# EAGLE schematic interface_board (EAGLE 7.1.0)
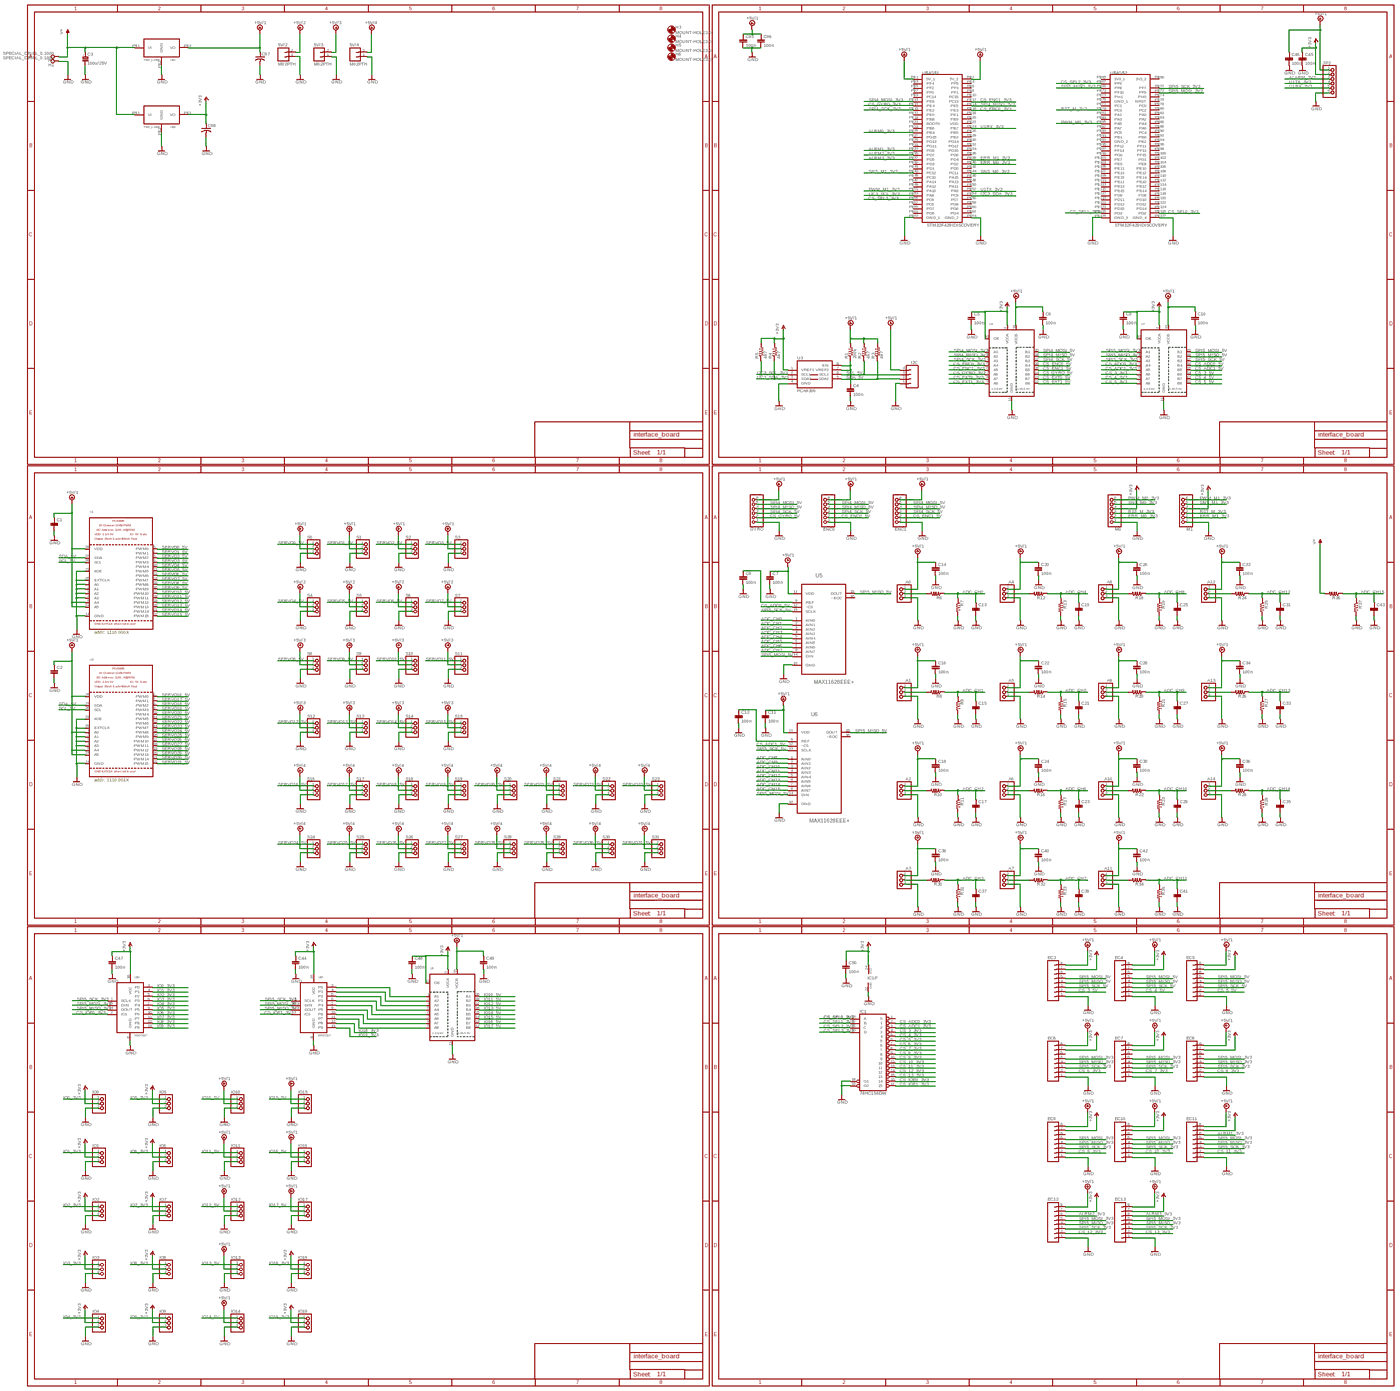
[diagram p0: schematic, sheet 1, overview]
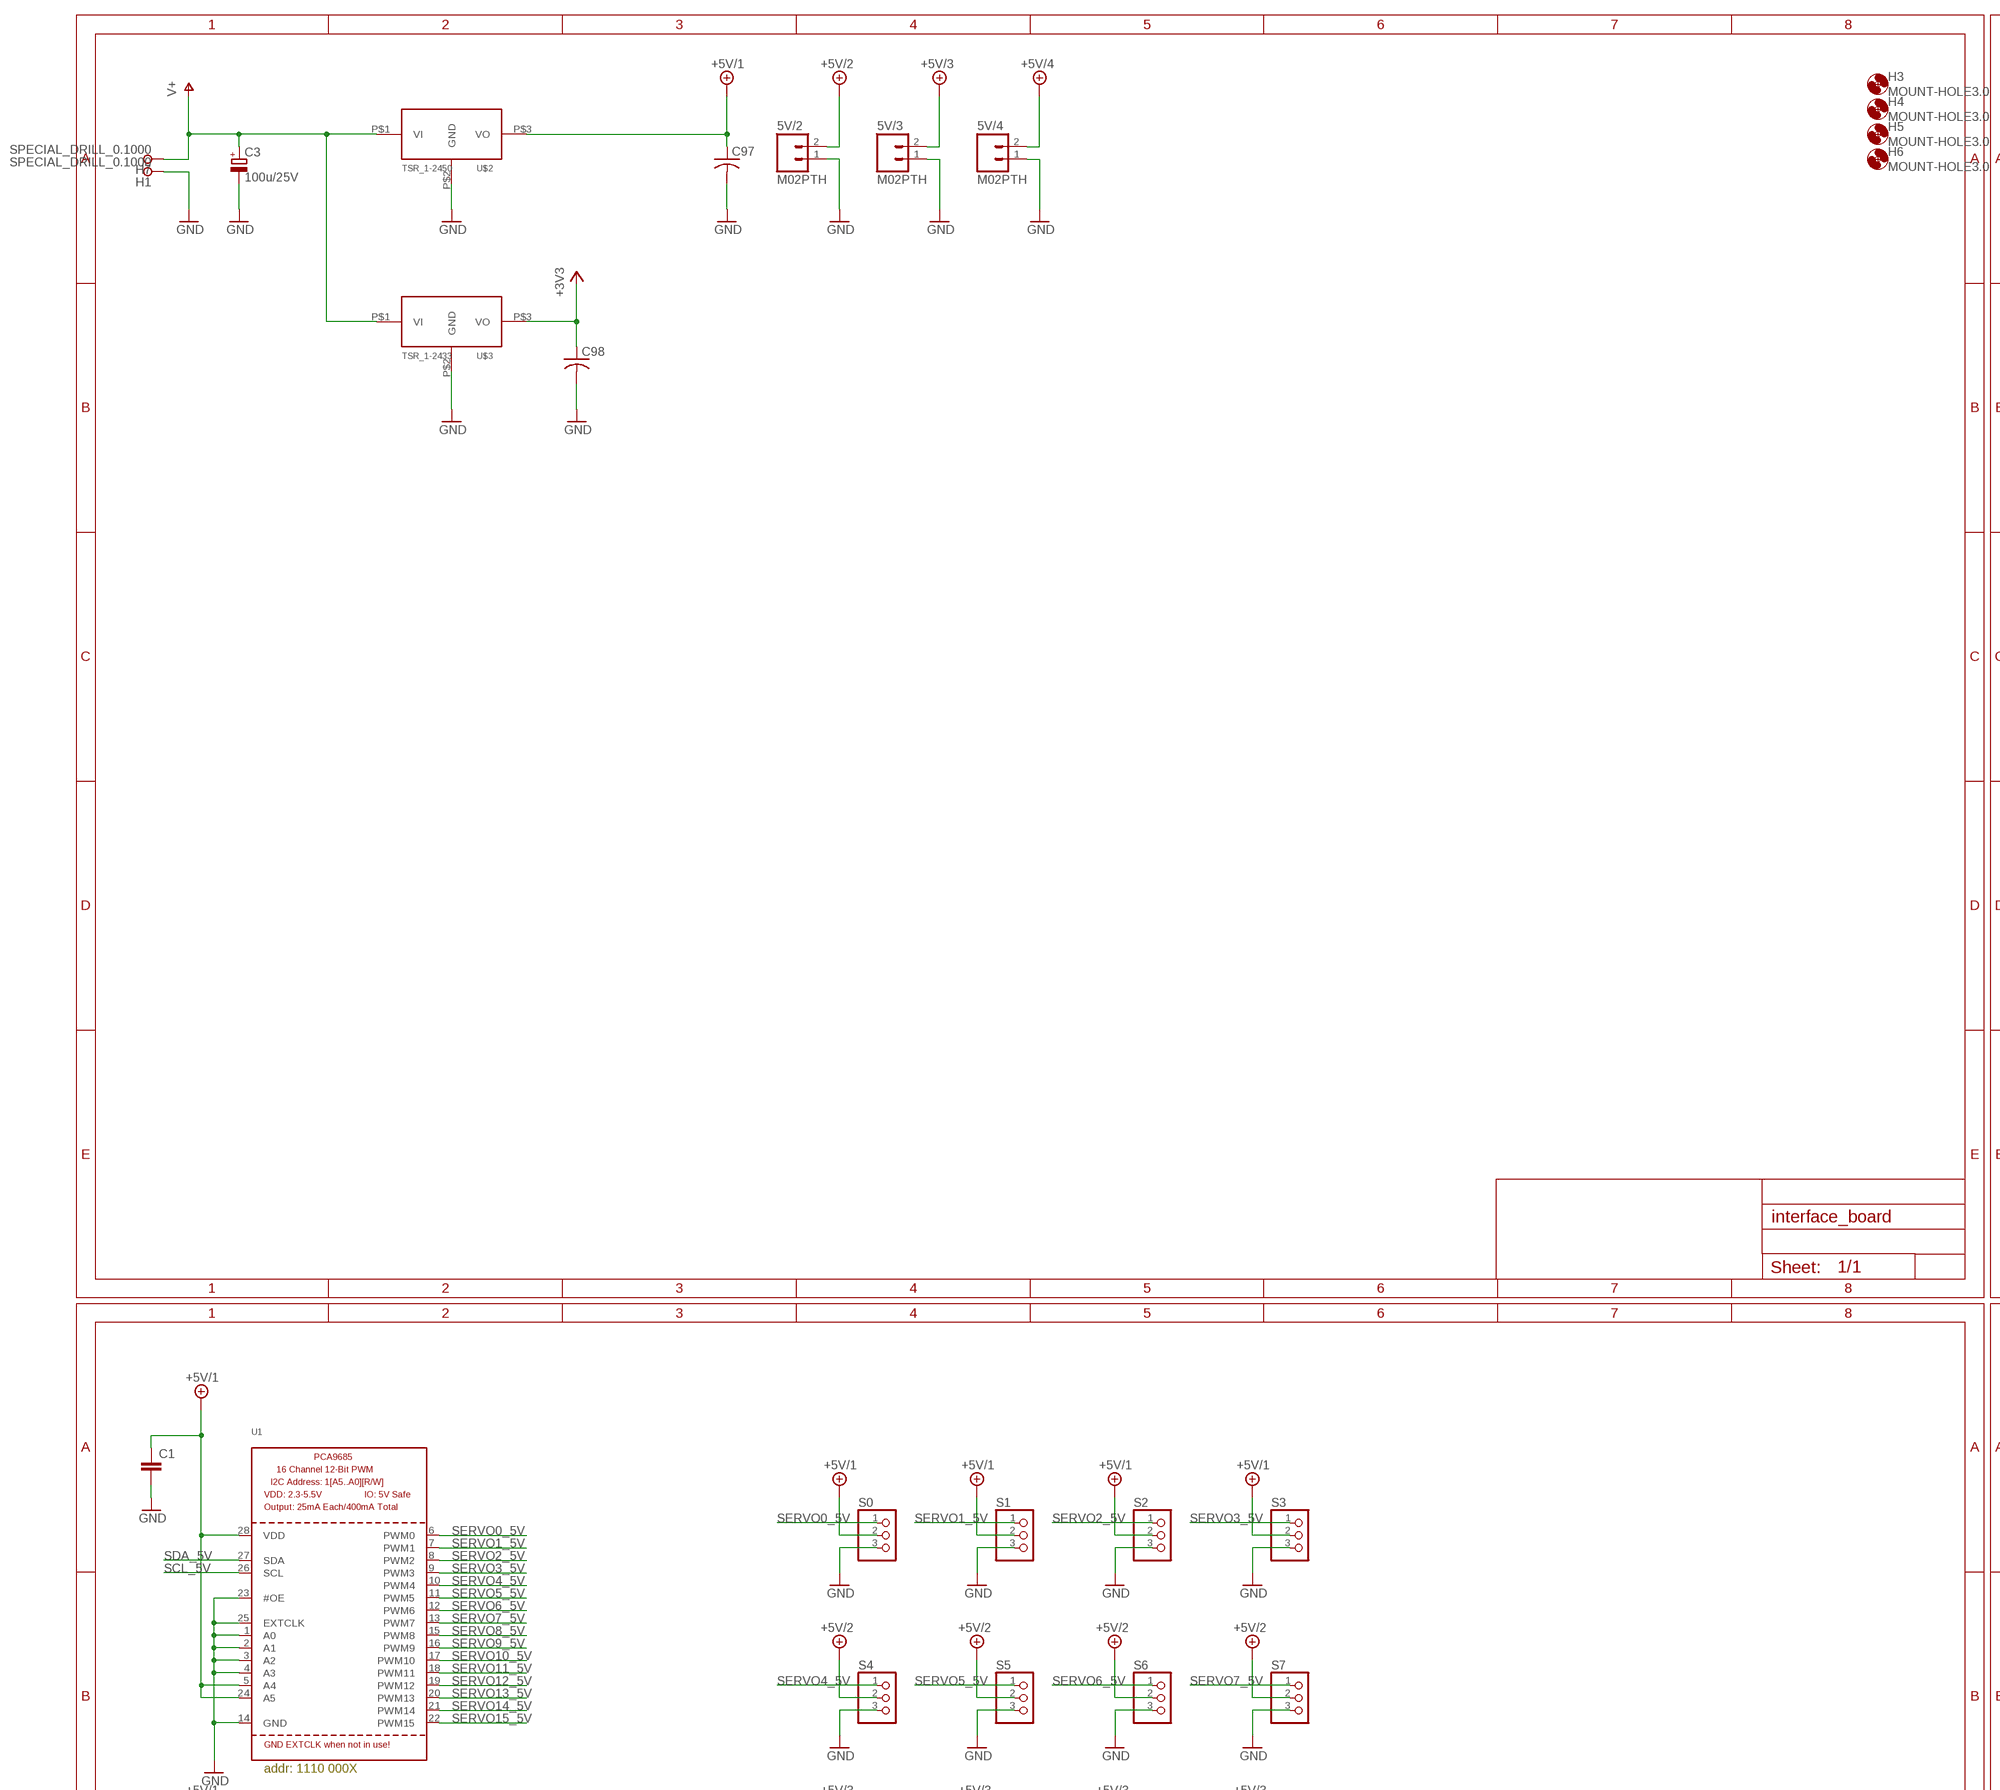
[diagram p1: schematic, sheet 1, part 1 of 4]
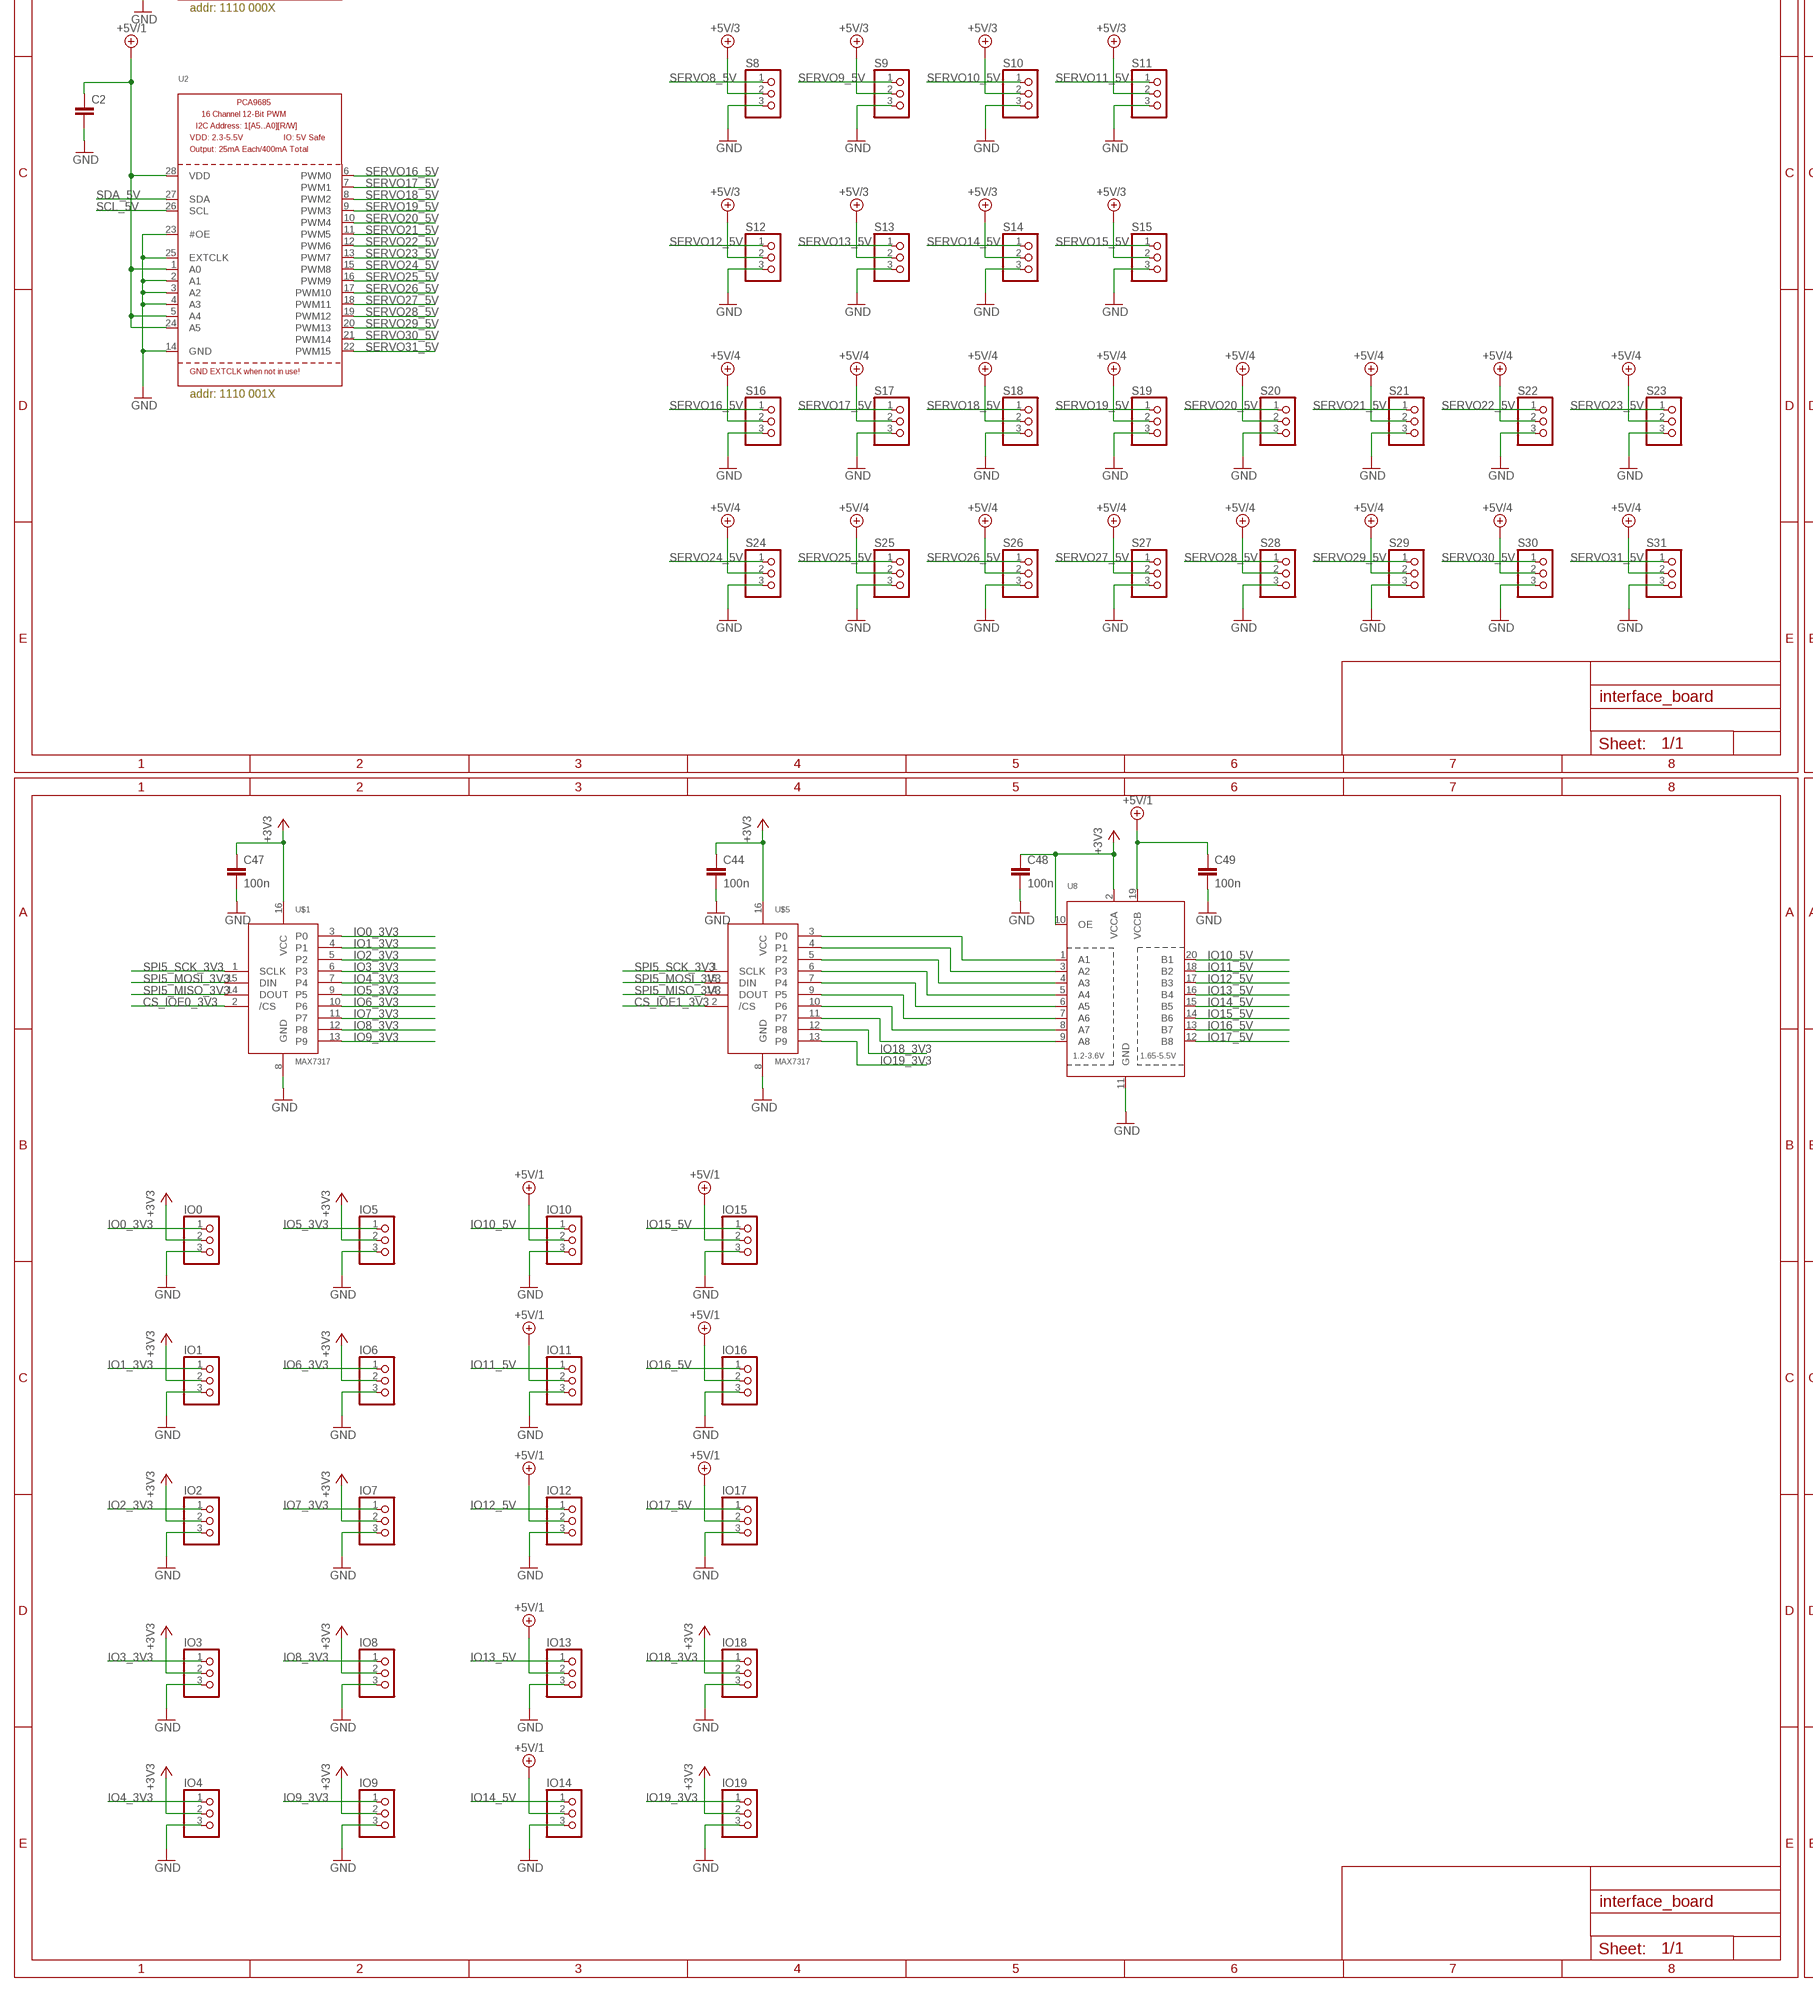
[diagram p2: schematic, sheet 1, part 2 of 4]
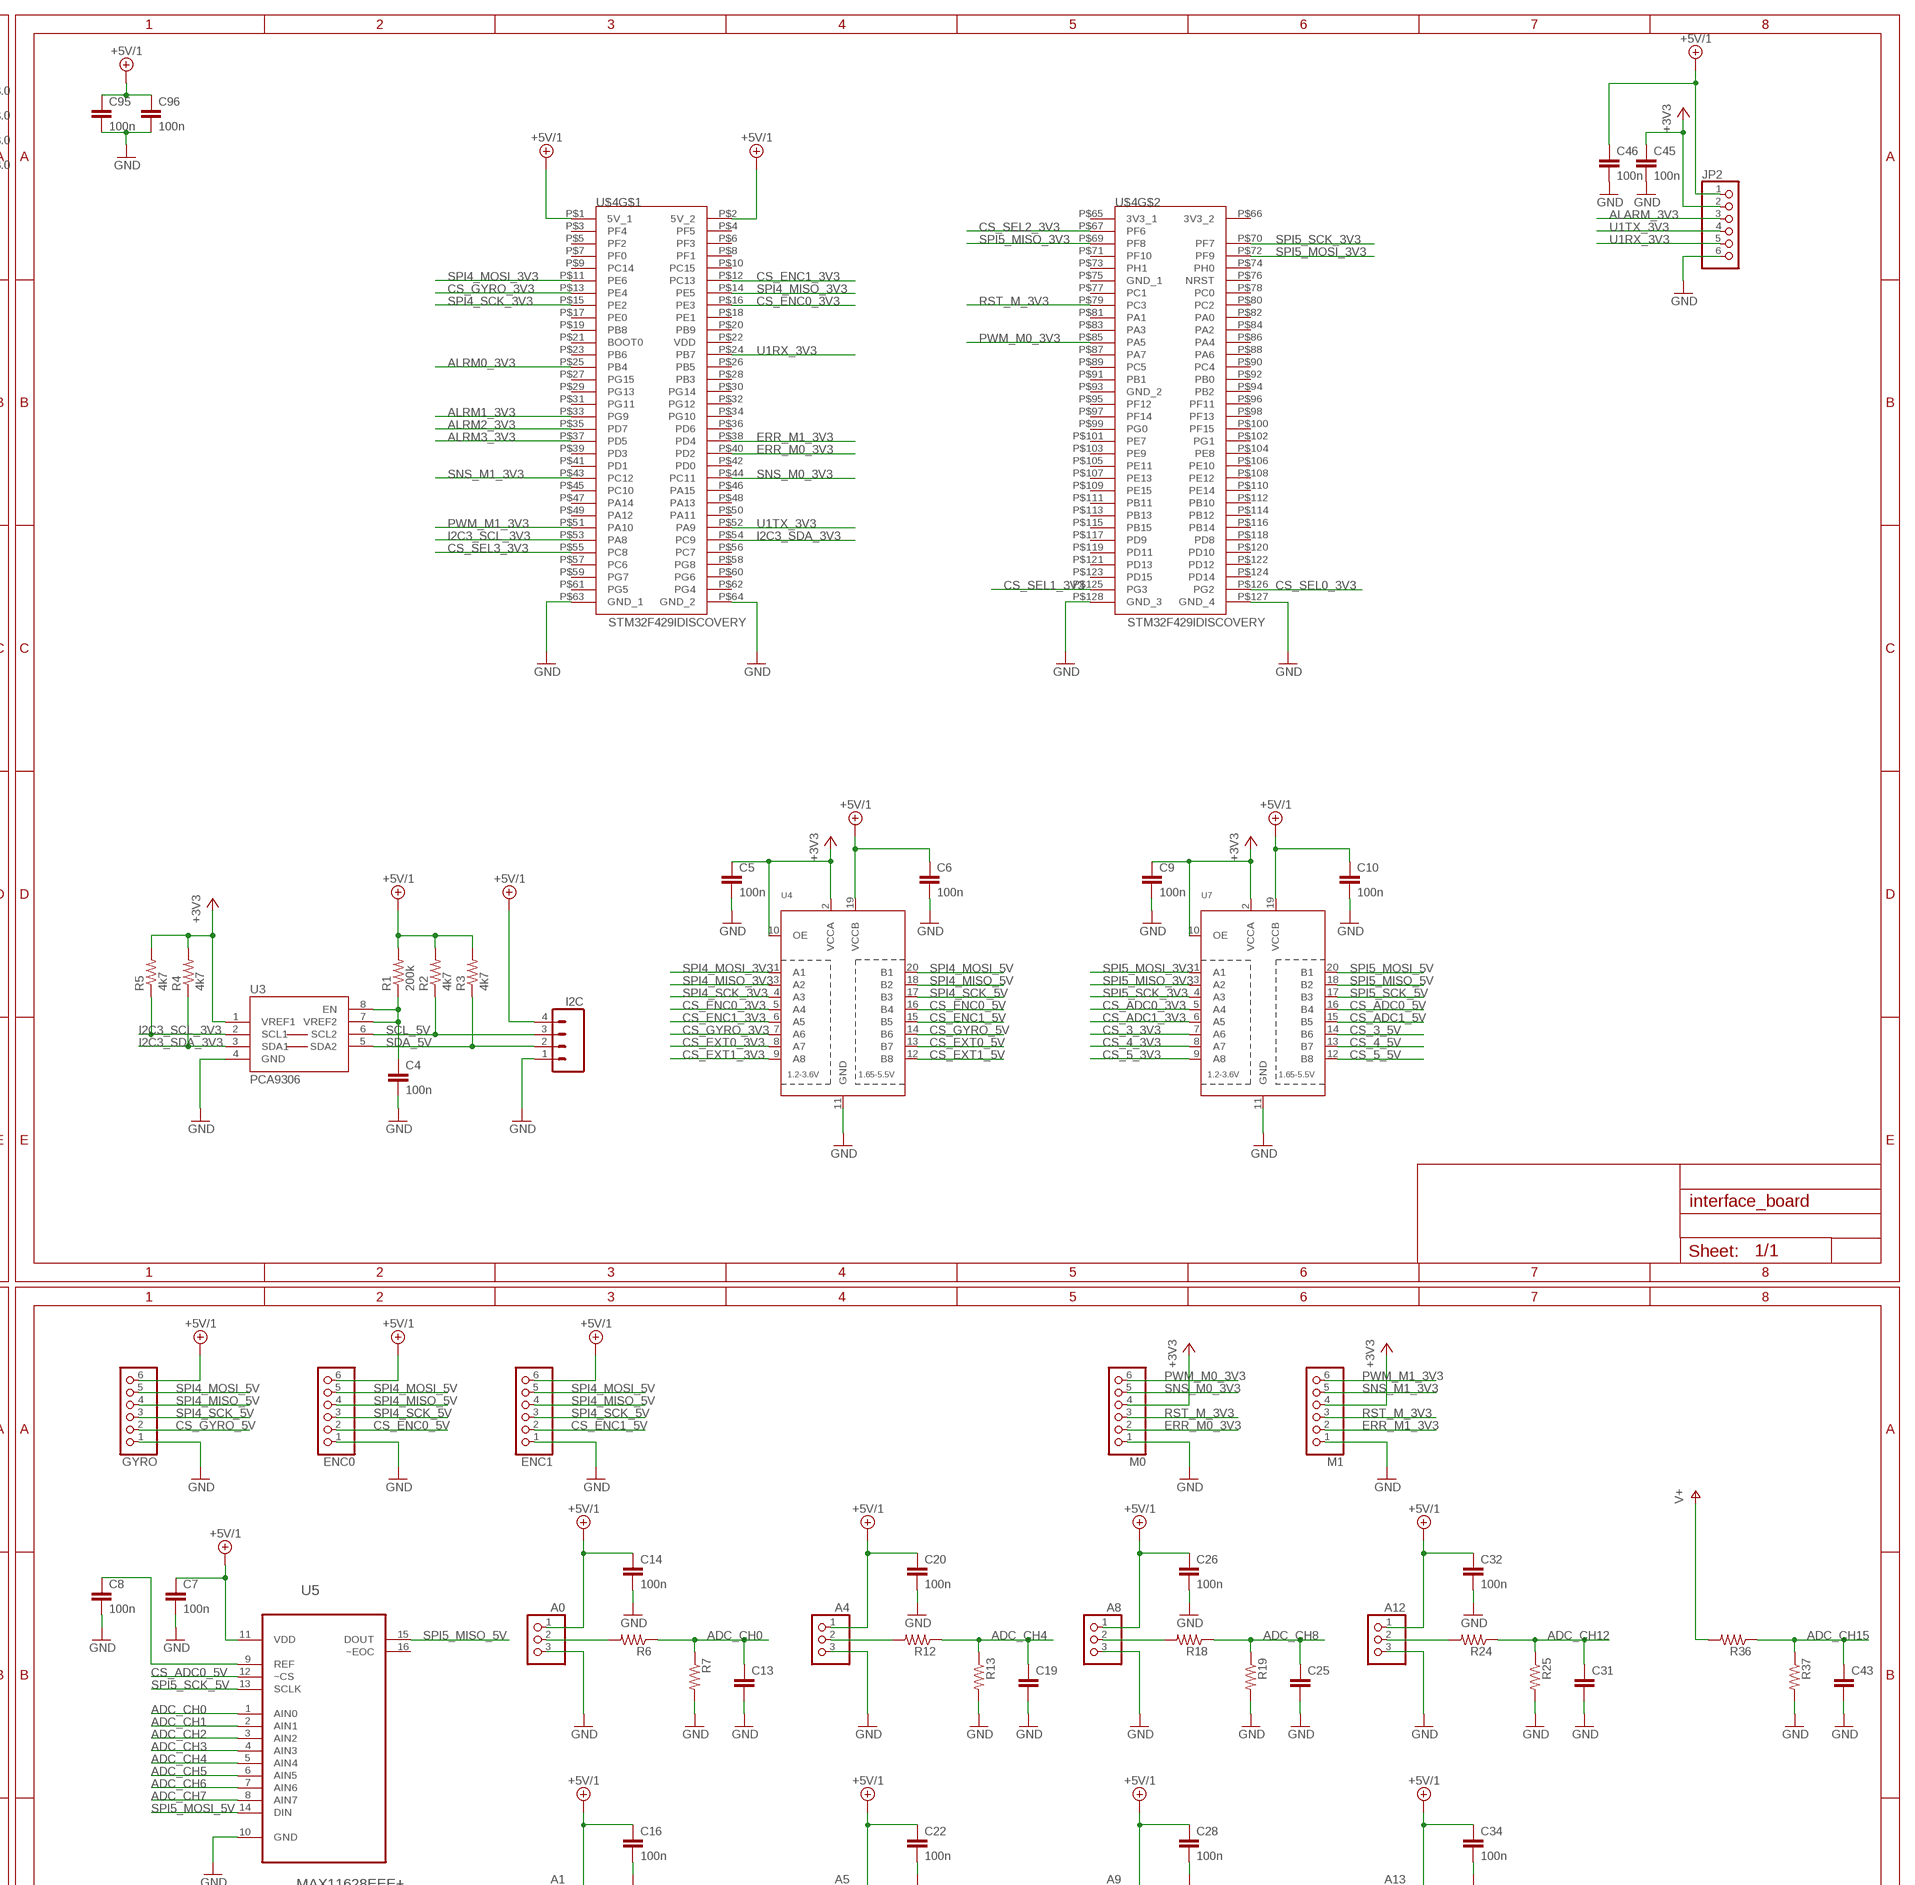
[diagram p3: schematic, sheet 1, part 3 of 4]
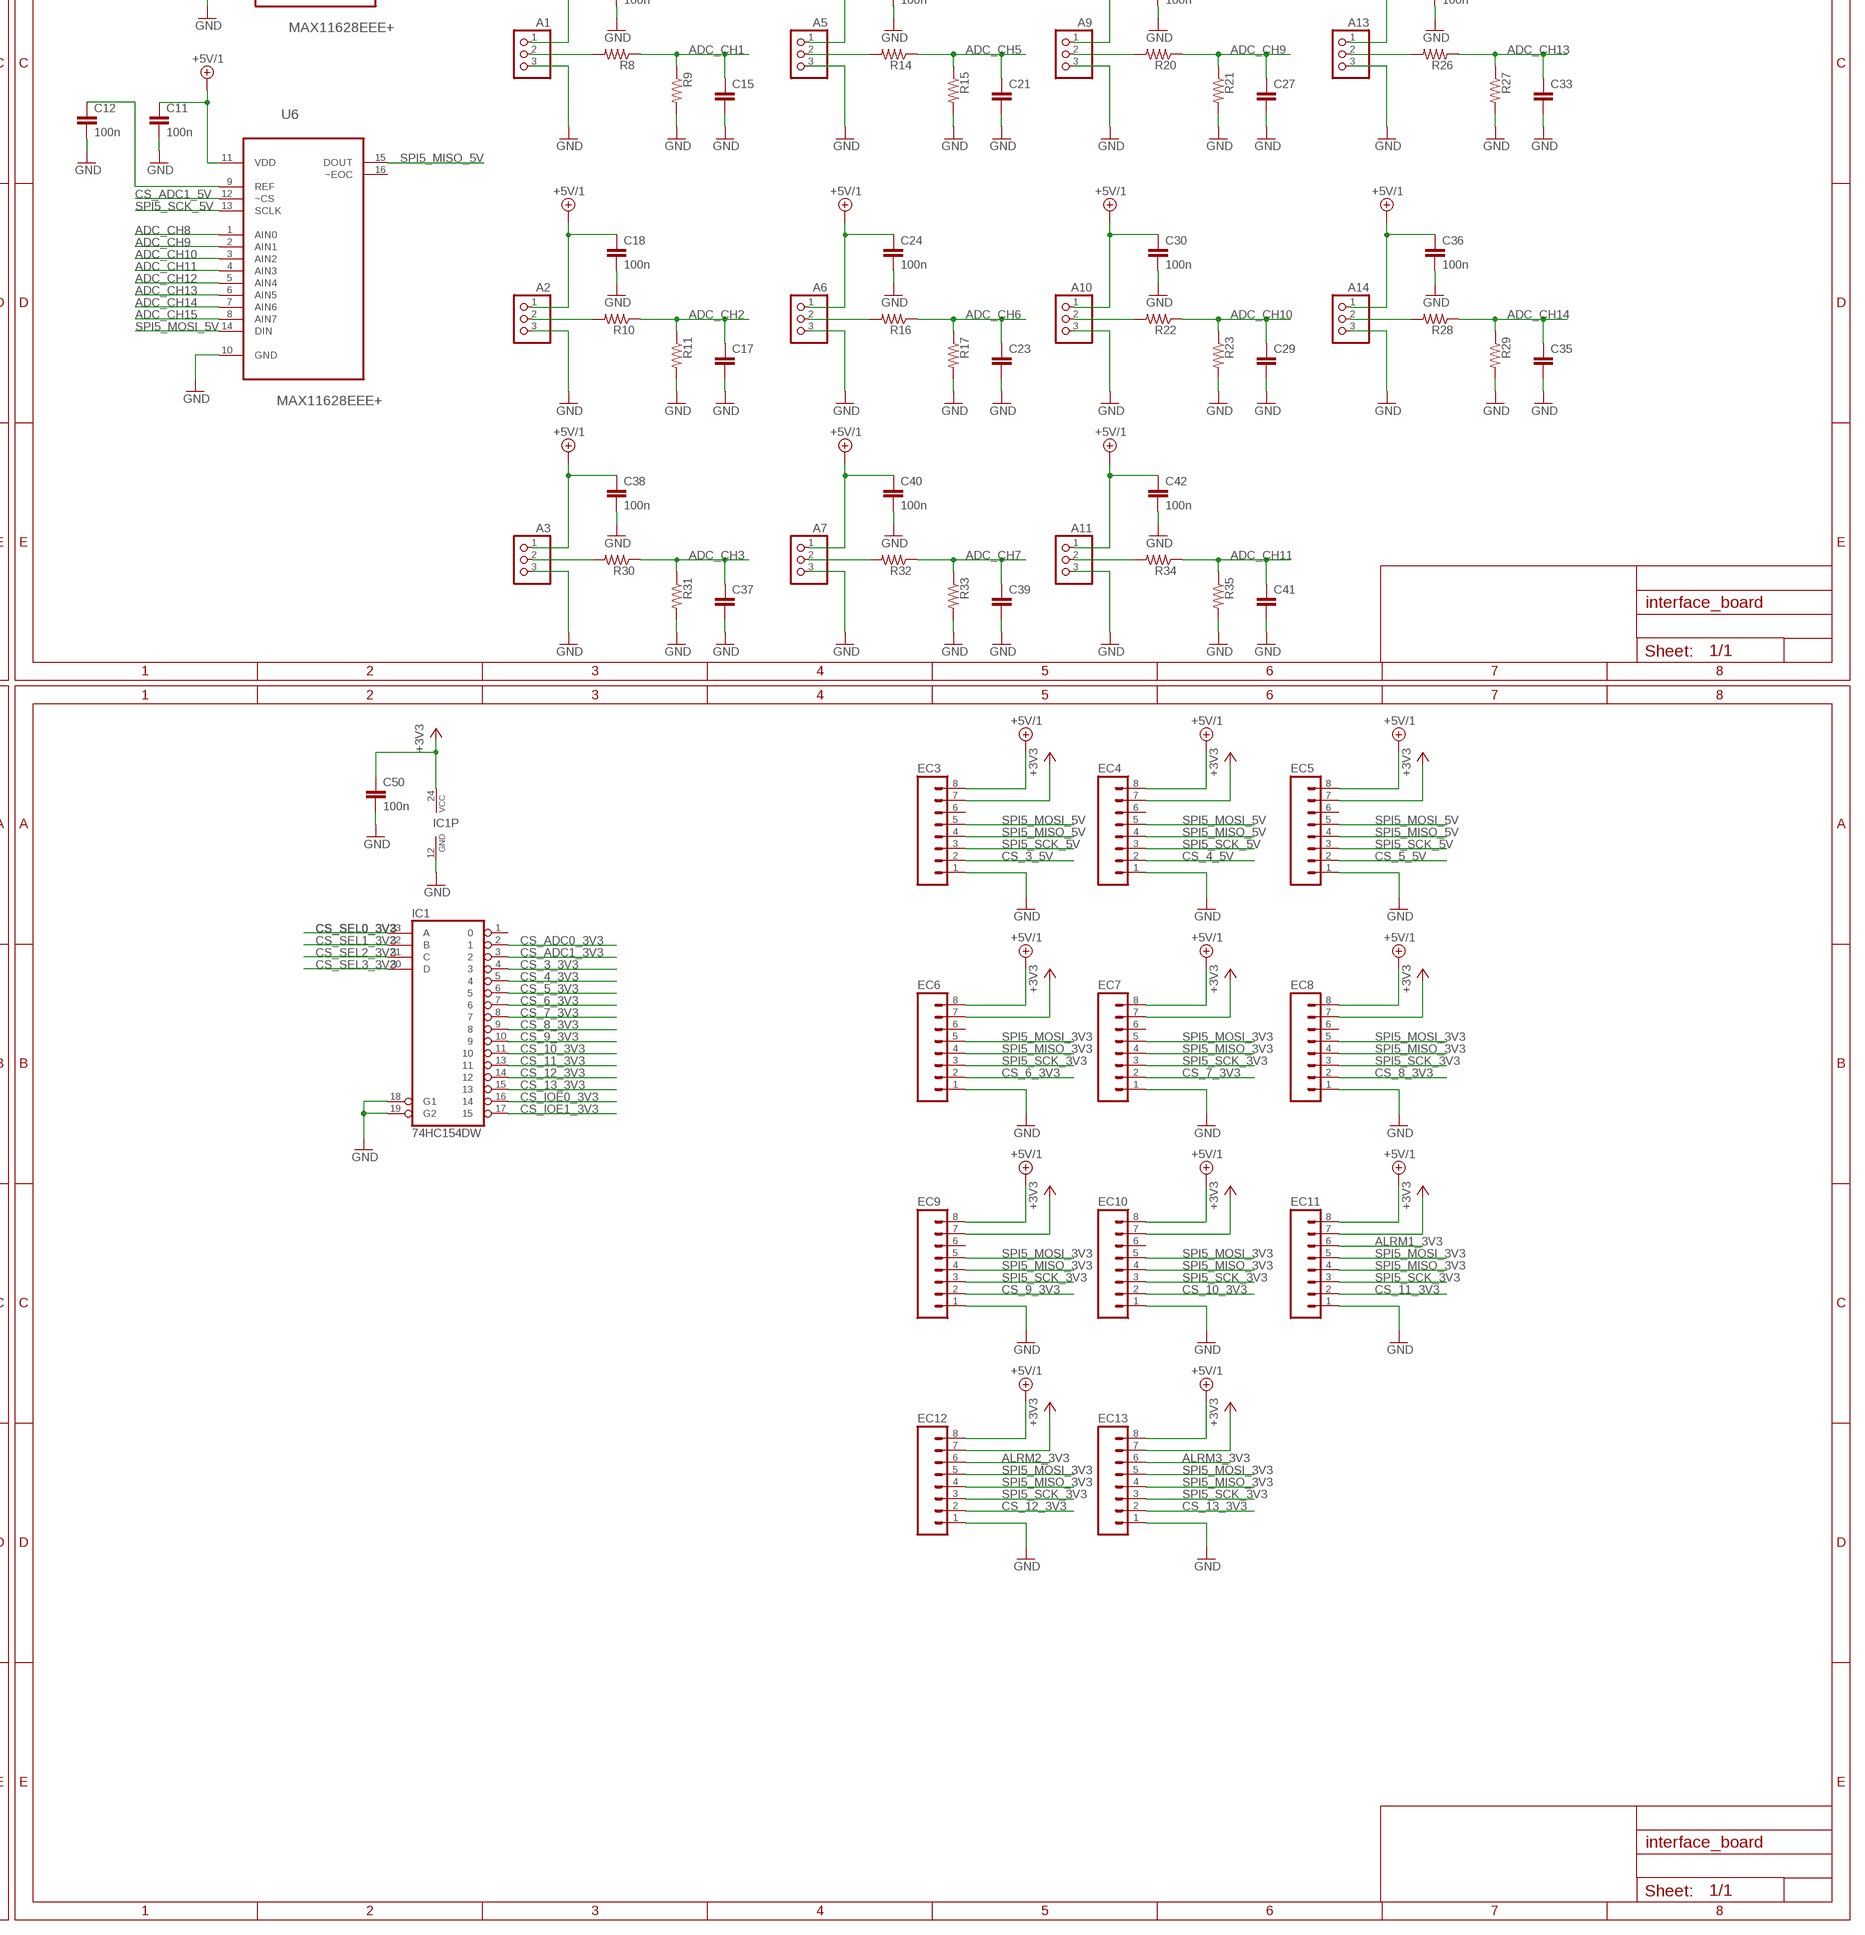
[diagram p4: schematic, sheet 1, part 4 of 4]

## Parts
5V/2  M02PTH  [1X02]
5V/3  M02PTH  [1X02]
5V/4  M02PTH  [1X02]
A0  PINHD-1X3  [1X03]
A1  PINHD-1X3  [1X03]
A2  PINHD-1X3  [1X03]
A3  PINHD-1X3  [1X03]
A4  PINHD-1X3  [1X03]
A5  PINHD-1X3  [1X03]
A6  PINHD-1X3  [1X03]
A7  PINHD-1X3  [1X03]
A8  PINHD-1X3  [1X03]
A9  PINHD-1X3  [1X03]
A10  PINHD-1X3  [1X03]
A11  PINHD-1X3  [1X03]
A12  PINHD-1X3  [1X03]
A13  PINHD-1X3  [1X03]
A14  PINHD-1X3  [1X03]
C1  C-EUC0603K  [C0603K]
C2  C-EUC0603K  [C0603K]
C3  100u/25V  CPOL-EUE  [PANASONIC_E]
C4  100n  C-EUC0603K  [C0603K]
C5  100n  C-EUC0603K  [C0603K]
C6  100n  C-EUC0603K  [C0603K]
C7  100n  C-EUC0603K  [C0603K]
C8  100n  C-EUC0603K  [C0603K]
C9  100n  C-EUC0603K  [C0603K]
C10  100n  C-EUC0603K  [C0603K]
C11  100n  C-EUC0603K  [C0603K]
C12  100n  C-EUC0603K  [C0603K]
C13  C-EUC0603K  [C0603K]
C14  100n  C-EUC0603K  [C0603K]
C15  C-EUC0603K  [C0603K]
C16  100n  C-EUC0603K  [C0603K]
C17  C-EUC0603K  [C0603K]
C18  100n  C-EUC0603K  [C0603K]
C19  C-EUC0603K  [C0603K]
C20  100n  C-EUC0603K  [C0603K]
C21  C-EUC0603K  [C0603K]
C22  100n  C-EUC0603K  [C0603K]
C23  C-EUC0603K  [C0603K]
C24  100n  C-EUC0603K  [C0603K]
C25  C-EUC0603K  [C0603K]
C26  100n  C-EUC0603K  [C0603K]
C27  C-EUC0603K  [C0603K]
C28  100n  C-EUC0603K  [C0603K]
C29  C-EUC0603K  [C0603K]
C30  100n  C-EUC0603K  [C0603K]
C31  C-EUC0603K  [C0603K]
C32  100n  C-EUC0603K  [C0603K]
C33  C-EUC0603K  [C0603K]
C34  100n  C-EUC0603K  [C0603K]
C35  C-EUC0603K  [C0603K]
C36  100n  C-EUC0603K  [C0603K]
C37  C-EUC0603K  [C0603K]
C38  100n  C-EUC0603K  [C0603K]
C39  C-EUC0603K  [C0603K]
C40  100n  C-EUC0603K  [C0603K]
C41  C-EUC0603K  [C0603K]
C42  100n  C-EUC0603K  [C0603K]
C43  C-EUC0603K  [C0603K]
C44  100n  C-EUC0603K  [C0603K]
C45  100n  C-EUC0603K  [C0603K]
C46  100n  C-EUC0603K  [C0603K]
C47  100n  C-EUC0603K  [C0603K]
C48  100n  C-EUC0603K  [C0603K]
C49  100n  C-EUC0603K  [C0603K]
C50  100n  C-EUC0603K  [C0603K]
C95  100n  C-EUC0603K  [C0603K]
C96  100n  C-EUC0603K  [C0603K]
C97  C-USC0805  [C0805]
C98  C-USC0805  [C0805]
EC3  M081X08  [1X08]
EC4  M081X08  [1X08]
EC5  M081X08  [1X08]
EC6  M081X08  [1X08]
EC7  M081X08  [1X08]
EC8  M081X08  [1X08]
EC9  M081X08  [1X08]
EC10  M081X08  [1X08]
EC11  M081X08  [1X08]
EC12  M081X08  [1X08]
EC13  M081X08  [1X08]
ENC0  PINHD-1X6  [1X06]
ENC1  PINHD-1X6  [1X06]
GYRO  PINHD-1X6  [1X06]
H1  SPECIAL_DRILL_0.1000  [PAD_0.1000]
H3  MOUNT-HOLE3.0  [3,0]
H4  MOUNT-HOLE3.0  [3,0]
H5  MOUNT-HOLE3.0  [3,0]
H6  MOUNT-HOLE3.0  [3,0]
H7  SPECIAL_DRILL_0.1000  [PAD_0.1000]
I2C  M04PTH  [1X04]
IC1  74HC154DW  [SO24W]
IO0  PINHD-1X3  [1X03]
IO1  PINHD-1X3  [1X03]
IO2  PINHD-1X3  [1X03]
IO3  PINHD-1X3  [1X03]
IO4  PINHD-1X3  [1X03]
IO5  PINHD-1X3  [1X03]
IO6  PINHD-1X3  [1X03]
IO7  PINHD-1X3  [1X03]
IO8  PINHD-1X3  [1X03]
IO9  PINHD-1X3  [1X03]
IO10  PINHD-1X3  [1X03]
IO11  PINHD-1X3  [1X03]
IO12  PINHD-1X3  [1X03]
IO13  PINHD-1X3  [1X03]
IO14  PINHD-1X3  [1X03]
IO15  PINHD-1X3  [1X03]
IO16  PINHD-1X3  [1X03]
IO17  PINHD-1X3  [1X03]
IO18  PINHD-1X3  [1X03]
IO19  PINHD-1X3  [1X03]
JP2  PINHD-1X6B  [1X06-BIG]
M0  PINHD-1X6  [1X06]
M1  PINHD-1X6  [1X06]
R1  200k  R-US_R0603  [R0603]
R2  4k7  R-US_R0603  [R0603]
R3  4k7  R-US_R0603  [R0603]
R4  4k7  R-US_R0603  [R0603]
R5  4k7  R-US_R0603  [R0603]
R6  R-US_R0603  [R0603]
R7  R-US_R0603  [R0603]
R8  R-US_R0603  [R0603]
R9  R-US_R0603  [R0603]
R10  R-US_R0603  [R0603]
R11  R-US_R0603  [R0603]
R12  R-US_R0603  [R0603]
R13  R-US_R0603  [R0603]
R14  R-US_R0603  [R0603]
R15  R-US_R0603  [R0603]
R16  R-US_R0603  [R0603]
R17  R-US_R0603  [R0603]
R18  R-US_R0603  [R0603]
R19  R-US_R0603  [R0603]
R20  R-US_R0603  [R0603]
R21  R-US_R0603  [R0603]
R22  R-US_R0603  [R0603]
R23  R-US_R0603  [R0603]
R24  R-US_R0603  [R0603]
R25  R-US_R0603  [R0603]
R26  R-US_R0603  [R0603]
R27  R-US_R0603  [R0603]
R28  R-US_R0603  [R0603]
R29  R-US_R0603  [R0603]
R30  R-US_R0603  [R0603]
R31  R-US_R0603  [R0603]
R32  R-US_R0603  [R0603]
R33  R-US_R0603  [R0603]
R34  R-US_R0603  [R0603]
R35  R-US_R0603  [R0603]
R36  R-US_R0603  [R0603]
R37  R-US_R0603  [R0603]
S0  PINHD-1X3  [1X03]
S1  PINHD-1X3  [1X03]
S2  PINHD-1X3  [1X03]
S3  PINHD-1X3  [1X03]
S4  PINHD-1X3  [1X03]
S5  PINHD-1X3  [1X03]
S6  PINHD-1X3  [1X03]
S7  PINHD-1X3  [1X03]
S8  PINHD-1X3  [1X03]
S9  PINHD-1X3  [1X03]
S10  PINHD-1X3  [1X03]
S11  PINHD-1X3  [1X03]
S12  PINHD-1X3  [1X03]
S13  PINHD-1X3  [1X03]
S14  PINHD-1X3  [1X03]
S15  PINHD-1X3  [1X03]
S16  PINHD-1X3  [1X03]
S17  PINHD-1X3  [1X03]
S18  PINHD-1X3  [1X03]
S19  PINHD-1X3  [1X03]
S20  PINHD-1X3  [1X03]
S21  PINHD-1X3  [1X03]
S22  PINHD-1X3  [1X03]
S23  PINHD-1X3  [1X03]
S24  PINHD-1X3  [1X03]
S25  PINHD-1X3  [1X03]
S26  PINHD-1X3  [1X03]
S27  PINHD-1X3  [1X03]
S28  PINHD-1X3  [1X03]
S29  PINHD-1X3  [1X03]
S30  PINHD-1X3  [1X03]
S31  PINHD-1X3  [1X03]
U1  PCA9685  [TSSOP28]
U2  PCA9685  [TSSOP28]
U3  PCA9306  [PSOP-8]
U4  TXB0108PWR  [TSSOP20]
U5  MAX11628EEE+  [SOP63P602X175-16N]
U6  MAX11628EEE+  [SOP63P602X175-16N]
U7  TXB0108PWR  [TSSOP20]
U8  TXB0108PWR  [TSSOP20]
U$1  MAX7317  [SOP63P600X175-16N]
U$2  TSR_1-2450  [TSR-1]
U$3  TSR_1-2433  [TSR-1]
U$4  STM32F429IDISCOVERY  [STM32F429IDISCOVERY]
U$5  MAX7317  [SOP63P600X175-16N]

## Nets
+3V3: C5.1 C9.1 C44.1 C45.1 C47.1 C48.1 C50.1 C98.1 EC3.7 EC4.7 EC5.7 EC6.7 EC7.7 EC8.7 EC9.7 EC10.7 EC11.7 EC12.7 EC13.7 IC1.24(VCC) IO0.2 IO1.2 IO2.2 IO3.2 IO4.2 IO5.2 IO6.2 IO7.2 IO8.2 IO9.2 IO18.2 IO19.2 JP2.2 M0.4 M1.4 R4.2 R5.2 U3.1(VREF1) U4.2(VCCA) U4.10(OE) U7.2(VCCA) U7.10(OE) U8.2(VCCA) U8.10(OE) U$1.16(VCC) U$3.P$3(VO) U$5.16(VCC)
+5V/1: A0.1 A1.1 A2.1 A3.1 A4.1 A5.1 A6.1 A7.1 A8.1 A9.1 A10.1 A11.1 A12.1 A13.1 A14.1 C1.1 C2.1 C6.1 C7.1 C10.1 C11.1 C14.1 C16.1 C18.1 C20.1 C22.1 C24.1 C26.1 C28.1 C30.1 C32.1 C34.1 C36.1 C38.1 C40.1 C42.1 C46.1 C49.1 C95.1 C96.1 C97.1 EC3.8 EC4.8 EC5.8 EC6.8 EC7.8 EC8.8 EC9.8 EC10.8 EC11.8 EC12.8 EC13.8 ENC0.6 ENC1.6 GYRO.6 I2C.4 IO10.2 IO11.2 IO12.2 IO13.2 IO14.2 IO15.2 IO16.2 IO17.2 JP2.1 R1.2 R2.2 R3.2 S0.2 S1.2 S2.2 S3.2 U1.5(A4) U1.24(A5) U1.28(VDD) U2.1(A0) U2.5(A4) U2.24(A5) U2.28(VDD) U4.19(VCCB) U5.11(VDD) U6.11(VDD) U7.19(VCCB) U8.19(VCCB) U$2.P$3(VO) U$4.P$1(5V_1) U$4.P$2(5V_2)
+5V/2: 5V/2.2 S4.2 S5.2 S6.2 S7.2
+5V/3: 5V/3.2 S8.2 S9.2 S10.2 S11.2 S12.2 S13.2 S14.2 S15.2
+5V/4: 5V/4.2 S16.2 S17.2 S18.2 S19.2 S20.2 S21.2 S22.2 S23.2 S24.2 S25.2 S26.2 S27.2 S28.2 S29.2 S30.2 S31.2
ADC_CH0: C13.1 R6.1 R7.1 U5.1(AIN0)
ADC_CH1: C15.1 R8.1 R9.1 U5.2(AIN1)
ADC_CH2: C17.1 R10.1 R11.1 U5.3(AIN2)
ADC_CH3: C37.1 R30.1 R31.1 U5.4(AIN3)
ADC_CH4: C19.1 R12.1 R13.1 U5.5(AIN4)
ADC_CH5: C21.1 R14.1 R15.1 U5.6(AIN5)
ADC_CH6: C23.1 R16.1 R17.1 U5.7(AIN6)
ADC_CH7: C39.1 R32.1 R33.1 U5.8(AIN7)
ADC_CH8: C25.1 R18.1 R19.1 U6.1(AIN0)
ADC_CH9: C27.1 R20.1 R21.1 U6.2(AIN1)
ADC_CH10: C29.1 R22.1 R23.1 U6.3(AIN2)
ADC_CH11: C41.1 R34.1 R35.1 U6.4(AIN3)
ADC_CH12: C31.1 R24.1 R25.1 U6.5(AIN4)
ADC_CH13: C33.1 R26.1 R27.1 U6.6(AIN5)
ADC_CH14: C35.1 R28.1 R29.1 U6.7(AIN6)
ADC_CH15: C43.1 R36.1 R37.1 U6.8(AIN7)
ALARM_3V3: JP2.3
ALRM0_3V3: U$4.P$25(PB4)
ALRM1_3V3: EC11.6 U$4.P$33(PG9)
ALRM2_3V3: EC12.6 U$4.P$35(PD7)
ALRM3_3V3: EC13.6 U$4.P$37(PD5)
CS_3_3V3: IC1.4 U7.7(A6)
CS_3_5V: EC3.2 U7.14(B6)
CS_4_3V3: IC1.5 U7.8(A7)
CS_4_5V: EC4.2 U7.13(B7)
CS_5_3V3: IC1.6 U7.9(A8)
CS_5_5V: EC5.2 U7.12(B8)
CS_6_3V3: EC6.2 IC1.7
CS_7_3V3: EC7.2 IC1.8
CS_8_3V3: EC8.2 IC1.9
CS_9_3V3: EC9.2 IC1.10
CS_10_3V3: EC10.2 IC1.11
CS_11_3V3: EC11.2 IC1.13
CS_12_3V3: EC12.2 IC1.14
CS_13_3V3: EC13.2 IC1.15
CS_ADC0_3V3: IC1.2 U7.5(A4)
CS_ADC0_5V: U5.12(~CS) U7.16(B4)
CS_ADC1_3V3: IC1.3 U7.6(A5)
CS_ADC1_5V: U6.12(~CS) U7.15(B5)
CS_ENC0_3V3: U4.5(A4) U$4.P$16(PE3)
CS_ENC0_5V: ENC0.2 U4.16(B4)
CS_ENC1_3V3: U4.6(A5) U$4.P$12(PC13)
CS_ENC1_5V: ENC1.2 U4.15(B5)
CS_EXT0_3V3: U4.8(A7)
CS_EXT0_5V: U4.13(B7)
CS_EXT1_3V3: U4.9(A8)
CS_EXT1_5V: U4.12(B8)
CS_GYRO_3V3: U4.7(A6) U$4.P$13(PE4)
CS_GYRO_5V: GYRO.2 U4.14(B6)
CS_IOE0_3V3: IC1.16 U$1.2(/CS)
CS_IOE1_3V3: IC1.17 U$5.2(/CS)
CS_SEL0_3V3: IC1.23(A) U$4.P$126(PG2)
CS_SEL1_3V3: IC1.22(B) U$4.P$125(PG3)
CS_SEL2_3V3: IC1.21(C) U$4.P$67(PF6)
CS_SEL3_3V3: IC1.20(D) U$4.P$55(PC8)
ERR_M0_3V3: M0.2 U$4.P$40(PD2)
ERR_M1_3V3: M1.2 U$4.P$38(PD4)
GND: 5V/2.1 5V/3.1 5V/4.1 A0.3 A1.3 A2.3 A3.3 A4.3 A5.3 A6.3 A7.3 A8.3 A9.3 A10.3 A11.3 A12.3 A13.3 A14.3 C1.2 C2.2 C3.- C4.2 C5.2 C6.2 C7.2 C8.2 C9.2 C10.2 C11.2 C12.2 C13.2 C14.2 C15.2 C16.2 C17.2 C18.2 C19.2 C20.2 C21.2 C22.2 C23.2 C24.2 C25.2 C26.2 C27.2 C28.2 C29.2 C30.2 C31.2 C32.2 C33.2 C34.2 C35.2 C36.2 C37.2 C38.2 C39.2 C40.2 C41.2 C42.2 C43.2 C44.2 C45.2 C46.2 C47.2 C48.2 C49.2 C50.2 C95.2 C96.2 C97.2 C98.2 EC3.1 EC4.1 EC5.1 EC6.1 EC7.1 EC8.1 EC9.1 EC10.1 EC11.1 EC12.1 EC13.1 ENC0.1 ENC1.1 GYRO.1 H1.1 I2C.1 IC1.12(GND) IC1.18(G1) IC1.19(G2) IO0.3 IO1.3 IO2.3 IO3.3 IO4.3 IO5.3 IO6.3 IO7.3 IO8.3 IO9.3 IO10.3 IO11.3 IO12.3 IO13.3 IO14.3 IO15.3 IO16.3 IO17.3 IO18.3 IO19.3 JP2.6 M0.1 M1.1 R7.2 R9.2 R11.2 R13.2 R15.2 R17.2 R19.2 R21.2 R23.2 R25.2 R27.2 R29.2 R31.2 R33.2 R35.2 R37.2 S0.3 S1.3 S2.3 S3.3 S4.3 S5.3 S6.3 S7.3 S8.3 S9.3 S10.3 S11.3 S12.3 S13.3 S14.3 S15.3 S16.3 S17.3 S18.3 S19.3 S20.3 S21.3 S22.3 S23.3 S24.3 S25.3 S26.3 S27.3 S28.3 S29.3 S30.3 S31.3 U1.1(A0) U1.2(A1) U1.3(A2) U1.4(A3) U1.14(GND) U1.23(#OE) U1.25(EXTCLK) U2.2(A1) U2.3(A2) U2.4(A3) U2.14(GND) U2.23(#OE) U2.25(EXTCLK) U3.4(GND) U4.11(GND) U5.10(GND) U6.10(GND) U7.11(GND) U8.11(GND) U$1.8(GND) U$2.P$2(GND) U$3.P$2(GND) U$4.P$63(GND_1) U$4.P$64(GND_2) U$4.P$127(GND_4) U$4.P$128(GND_3) U$5.8(GND)
I2C3_SCL_3V3: R5.1 U3.2(SCL1) U$4.P$53(PA8)
I2C3_SDA_3V3: R4.1 U3.3(SDA1) U$4.P$54(PC9)
IO0_3V3: IO0.1 U$1.3(P0)
IO1_3V3: IO1.1 U$1.4(P1)
IO2_3V3: IO2.1 U$1.5(P2)
IO3_3V3: IO3.1 U$1.6(P3)
IO4_3V3: IO4.1 U$1.7(P4)
IO5_3V3: IO5.1 U$1.9(P5)
IO6_3V3: IO6.1 U$1.10(P6)
IO7_3V3: IO7.1 U$1.11(P7)
IO8_3V3: IO8.1 U$1.12(P8)
IO9_3V3: IO9.1 U$1.13(P9)
IO10_5V: IO10.1 U8.20(B1)
IO11_5V: IO11.1 U8.18(B2)
IO12_5V: IO12.1 U8.17(B3)
IO13_5V: IO13.1 U8.16(B4)
IO14_5V: IO14.1 U8.15(B5)
IO15_5V: IO15.1 U8.14(B6)
IO16_5V: IO16.1 U8.13(B7)
IO17_5V: IO17.1 U8.12(B8)
IO18_3V3: IO18.1 U$5.12(P8)
IO19_3V3: IO19.1 U$5.13(P9)
N$1: C8.1 U5.9(REF)
N$2: C12.1 U6.9(REF)
N$3: C4.1 R1.1 U3.7(VREF2) U3.8(EN)
N$4: A1.2 R8.2
N$5: U8.1(A1) U$5.3(P0)
N$6: A2.2 R10.2
N$7: A0.2 R6.2
N$8: A4.2 R12.2
N$9: A5.2 R14.2
N$10: A6.2 R16.2
N$11: A8.2 R18.2
N$12: A9.2 R20.2
N$13: A10.2 R22.2
N$14: A12.2 R24.2
N$15: A13.2 R26.2
N$16: A14.2 R28.2
N$17: A3.2 R30.2
N$18: A7.2 R32.2
N$19: A11.2 R34.2
N$20: U8.3(A2) U$5.4(P1)
N$21: U8.4(A3) U$5.5(P2)
N$22: U8.5(A4) U$5.6(P3)
N$23: U8.6(A5) U$5.7(P4)
N$24: U8.7(A6) U$5.9(P5)
N$25: U8.8(A7) U$5.10(P6)
N$26: U8.9(A8) U$5.11(P7)
PWM_M0_3V3: M0.6 U$4.P$85(PA5)
PWM_M1_3V3: M1.6 U$4.P$51(PA10)
RST_M_3V3: M0.3 M1.3 U$4.P$79(PC3)
SCL_5V: I2C.3 R2.1 U1.26(SCL) U2.26(SCL) U3.6(SCL2)
SDA_5V: I2C.2 R3.1 U1.27(SDA) U2.27(SDA) U3.5(SDA2)
SERVO0_5V: S0.1 U1.6(PWM0)
SERVO1_5V: S1.1 U1.7(PWM1)
SERVO2_5V: S2.1 U1.8(PWM2)
SERVO3_5V: S3.1 U1.9(PWM3)
SERVO4_5V: S4.1 U1.10(PWM4)
SERVO5_5V: S5.1 U1.11(PWM5)
SERVO6_5V: S6.1 U1.12(PWM6)
SERVO7_5V: S7.1 U1.13(PWM7)
SERVO8_5V: S8.1 U1.15(PWM8)
SERVO9_5V: S9.1 U1.16(PWM9)
SERVO10_5V: S10.1 U1.17(PWM10)
SERVO11_5V: S11.1 U1.18(PWM11)
SERVO12_5V: S12.1 U1.19(PWM12)
SERVO13_5V: S13.1 U1.20(PWM13)
SERVO14_5V: S14.1 U1.21(PWM14)
SERVO15_5V: S15.1 U1.22(PWM15)
SERVO16_5V: S16.1 U2.6(PWM0)
SERVO17_5V: S17.1 U2.7(PWM1)
SERVO18_5V: S18.1 U2.8(PWM2)
SERVO19_5V: S19.1 U2.9(PWM3)
SERVO20_5V: S20.1 U2.10(PWM4)
SERVO21_5V: S21.1 U2.11(PWM5)
SERVO22_5V: S22.1 U2.12(PWM6)
SERVO23_5V: S23.1 U2.13(PWM7)
SERVO24_5V: S24.1 U2.15(PWM8)
SERVO25_5V: S25.1 U2.16(PWM9)
SERVO26_5V: S26.1 U2.17(PWM10)
SERVO27_5V: S27.1 U2.18(PWM11)
SERVO28_5V: S28.1 U2.19(PWM12)
SERVO29_5V: S29.1 U2.20(PWM13)
SERVO30_5V: S30.1 U2.21(PWM14)
SERVO31_5V: S31.1 U2.22(PWM15)
SNS_M0_3V3: M0.5 U$4.P$44(PC11)
SNS_M1_3V3: M1.5 U$4.P$43(PC12)
SPI4_MISO_3V3: U4.3(A2) U$4.P$14(PE5)
SPI4_MISO_5V: ENC0.4 ENC1.4 GYRO.4 U4.18(B2)
SPI4_MOSI_3V3: U4.1(A1) U$4.P$11(PE6)
SPI4_MOSI_5V: ENC0.5 ENC1.5 GYRO.5 U4.20(B1)
SPI4_SCK_3V3: U4.4(A3) U$4.P$15(PE2)
SPI4_SCK_5V: ENC0.3 ENC1.3 GYRO.3 U4.17(B3)
SPI5_MISO_3V3: EC6.4 EC7.4 EC8.4 EC9.4 EC10.4 EC11.4 EC12.4 EC13.4 U7.3(A2) U$1.14(DOUT) U$4.P$69(PF8) U$5.14(DOUT)
SPI5_MISO_5V: EC3.4 EC4.4 EC5.4 U5.15(DOUT) U6.15(DOUT) U7.18(B2)
SPI5_MOSI_3V3: EC6.5 EC7.5 EC8.5 EC9.5 EC10.5 EC11.5 EC12.5 EC13.5 U7.1(A1) U$1.15(DIN) U$4.P$72(PF9) U$5.15(DIN)
SPI5_MOSI_5V: EC3.5 EC4.5 EC5.5 U5.14(DIN) U6.14(DIN) U7.20(B1)
SPI5_SCK_3V3: EC6.3 EC7.3 EC8.3 EC9.3 EC10.3 EC11.3 EC12.3 EC13.3 U7.4(A3) U$1.1(SCLK) U$4.P$70(PF7) U$5.1(SCLK)
SPI5_SCK_5V: EC3.3 EC4.3 EC5.3 U5.13(SCLK) U6.13(SCLK) U7.17(B3)
U1RX_3V3: JP2.5 U$4.P$24(PB7)
U1TX_3V3: JP2.4 U$4.P$52(PA9)
V+: C3.+ H7.1 R36.2 U$2.P$1(VI) U$3.P$1(VI)
Unconnected: EC3.6 EC4.6 EC5.6 EC6.6 EC7.6 EC8.6 EC9.6 EC10.6 IC1.1 U5.16(~EOC) U6.16(~EOC) U$4.P$3(PF4) U$4.P$4(PF5) U$4.P$5(PF2) U$4.P$6(PF3) U$4.P$7(PF0) U$4.P$8(PF1) U$4.P$9(PC14) U$4.P$10(PC15) U$4.P$17(PE0) U$4.P$18(PE1) U$4.P$19(PB8) U$4.P$20(PB9) U$4.P$21(BOOT0) U$4.P$22(VDD) U$4.P$23(PB6) U$4.P$26(PB5) U$4.P$27(PG15) U$4.P$28(PB3) U$4.P$29(PG13) U$4.P$30(PG14) U$4.P$31(PG11) U$4.P$32(PG12) U$4.P$34(PG10) U$4.P$36(PD6) U$4.P$39(PD3) U$4.P$41(PD1) U$4.P$42(PD0) U$4.P$45(PC10) U$4.P$46(PA15) U$4.P$47(PA14) U$4.P$48(PA13) U$4.P$49(PA12) U$4.P$50(PA11) U$4.P$56(PC7) U$4.P$57(PC6) U$4.P$58(PG8) U$4.P$59(PG7) U$4.P$60(PG6) U$4.P$61(PG5) U$4.P$62(PG4) U$4.P$65(3V3_1) U$4.P$66(3V3_2) U$4.P$71(PF10) U$4.P$73(PH1) U$4.P$74(PH0) U$4.P$75(GND_1) U$4.P$76(NRST) U$4.P$77(PC1) U$4.P$78(PC0) U$4.P$80(PC2) U$4.P$81(PA1) U$4.P$82(PA0) U$4.P$83(PA3) U$4.P$84(PA2) U$4.P$86(PA4) U$4.P$87(PA7) U$4.P$88(PA6) U$4.P$89(PC5) U$4.P$90(PC4) U$4.P$91(PB1) U$4.P$92(PB0) U$4.P$93(GND_2) U$4.P$94(PB2) U$4.P$95(PF12) U$4.P$96(PF11) U$4.P$97(PF14) U$4.P$98(PF13) U$4.P$99(PG0) U$4.P$100(PF15) U$4.P$101(PE7) U$4.P$102(PG1) U$4.P$103(PE9) U$4.P$104(PE8) U$4.P$105(PE11) U$4.P$106(PE10) U$4.P$107(PE13) U$4.P$108(PE12) U$4.P$109(PE15) U$4.P$110(PE14) U$4.P$111(PB11) U$4.P$112(PB10) U$4.P$113(PB13) U$4.P$114(PB12) U$4.P$115(PB15) U$4.P$116(PB14) U$4.P$117(PD9) U$4.P$118(PD8) U$4.P$119(PD11) U$4.P$120(PD10) U$4.P$121(PD13) U$4.P$122(PD12) U$4.P$123(PD15) U$4.P$124(PD14)

## Notes on the sheet
- addr: 1110 000X
- addr: 1110 001X

## Library data of the parts
5V/2-5V/4 = SparkFun-Connectors:M02: Standard 2-pin 0.1" header. Use with - straight break away headers ( PRT-00116) - right angle break away headers (PRT-00553) - swiss pins (PRT-00743) - machine pins (PRT-00117) - female headers (PRT-00115) Molex polarized connector foot print use with: PRT-08233 with associated crimp pins and housings. 2.54_SCREWTERM for use with PRT-10571. 3.5mm Screw Terminal footprints for PRT-08084 5mm Screw Terminal footprints for use with PRT-08432
A0 A1-A14 IO0 IO1-IO19 S0 S1-S31 = adafruit:PINHD-1X3: PIN HEADER
C1 C2 C4-C50 C95 C96 = rcl:C-EU: CAPACITOR, European symbol
C3 = rcl:CPOL-EU: POLARIZED CAPACITOR, European symbol
C97 C98 = resistor:C-US: CAPACITOR, American symbol
EC3-EC13 = SparkFun-Connectors:M08: Header 8 Standard 8-pin 0.1" header. Use with straight break away headers (SKU : PRT-00116), right angle break away headers (PRT-00553), swiss pins (PRT-00743), machine pins (PRT-00117), and female headers (PRT-00115).
ENC0 ENC1 GYRO JP2 M0 M1 = adafruit:PINHD-1X6: PIN HEADER
H1 H7 = special-drill:SPECIAL_DRILL_: Special drills
H3-H6 = holes:MOUNT-HOLE: MOUNTING HOLE with drill center marker
I2C = SparkFun-Connectors:M04: Header 4 Standard 4-pin 0.1" header. Use with straight break away headers (SKU : PRT-00116), right angle break away headers (PRT-00553), swiss pins (PRT-00743), machine pins (PRT-00117), and female headers (PRT-00115). Molex polarized connector foot print use with SKU : PRT-08231 with associated crimp pins and housings. 1MM SMD Version SKU: PRT-10208
IC1 = 74xx-eu:74*154: 4-line to 16-line data SELECTOR/MULTIPLEXER
R1-R37 = rcl:R-US_: RESISTOR, American symbol
U1 U2 = adafruit:PCA9685: PCA9685 - 16 Channel 12-Bit I2C PWM Controller 5.0V tolerant 16 channel, 12-bit I2C PWM controller with 25mA per output (max. 400mA total) Digikey: 568-5931-1-ND
U3 = SparkFun-DigitalIC:PCA9306: Bidirectional I2C level shifter. NOT compatible with all available part number pinout schemes- DOUBLE CHECK!!!; PROD_ID: IC-10023
U4 U7 U8 = adafruit:TXB0108PWR: 8-Bit Bi-Directional Level Shifter 1.2V-3.6V (VCCA) to 1.65V-5.5V (VCCB) bi-directional level shifter with auto direction sensing. Max data rate - VCCA 1.8V: 20Mbps (50ns), VCCA 3.3V: 100Mbps (10ns) Digikey: 296-21527-1-ND
U5 U6 = Maxim_By_element14_Batch_1:MAX11628EEE+: 12-Bit, 300ksps ADCs with FIFO and Internal Reference; MPN: MAX11628EEE+; OC_FARNELL: -; OC_NEWARK: 86R2467; PACKAGE: QSOP-16; SUPPLIER: Maxim
U$1 U$5 = perso:MAX7317
U$2 = perso:TSR_1-2450
U$3 = perso:TSR_1-2433
U$4 = perso:STM32F429IDISCOVERY